# Altium schematic sheet Lora.SchDoc
size A; SheetNumber: 4; SheetTotal: 11
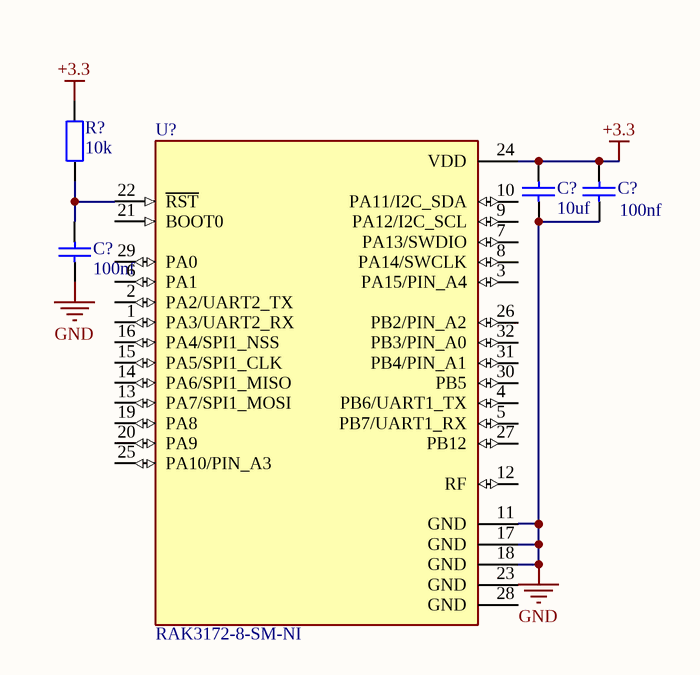
[diagram p0: Lora.SchDoc]

## Parts
(Parts that share a designator on the sheet are numbered #1, #2 ... from top to bottom, then left to right.)
C?#1  10uf  [tu 0805]
C?#2  100nf  [tu 0805]
C?#3  100nf  [tu 0805]
R?  10k  [tro smd 0805]
U?  RAK3172-8-SM-NI  [XCVR_RAK3172-8-SM-NI]

## Nets
+3.3: C?#1.1 C?#2.1 R?.2 U?.24(VDD)
GND: C?#1.2 C?#2.2 C?#3.2 U?.11(GND) U?.17(GND) U?.18(GND)
NetC?#3_1: C?#3.1 R?.1 U?.22(~{RST})

Not connected (* = marked no-connect by the designer): U? 1(PA3/UART2_RX) 2(PA2/UART2_TX) 3(PA15/PIN_A4) 4(PB6/UART1_TX) 5(PB7/UART1_RX) 6(PA1) 7(PA13/SWDIO) 8(PA14/SWCLK) 9(PA12/I2C_SCL) 10(PA11/I2C_SDA) 12(RF) 13(PA7/SPI1_MOSI) 14(PA6/SPI1_MISO) 15(PA5/SPI1_CLK) 16(PA4/SPI1_NSS) 19(PA8) 20(PA9) 21(BOOT0) 23(GND) 25(PA10/PIN_A3) 26(PB2/PIN_A2) 27(PB12) 28(GND) 29(PA0) 30(PB5) 31(PB4/PIN_A1) 32(PB3/PIN_A0)

## Library data of the parts
C?#1-C?#3 = Tu 0805 104 50V 10%: Dán; Don_Vi: Con; So_Chan: 2; Ten_Linh_Kien: Tụ 0805 104-100nF 10% 50V; Ma_Hang: MH004551; Chung_Loai: Dán; Kieu_Chan: *
R? = Tro 0805 1% 10R: Dán; Don_Vi: Con; So_Chan: 2; Ten_Linh_Kien: Trở 0805 1% 10R; Ma_Hang: MH005474; Chung_Loai: Dán; Kieu_Chan: *
U? = RAK3172-8-SM-NI: RF IC Transceiver LoRaWAN 864MHz, 865MHz, 868MHz 2V ~ 3.6V Supply, Without IPEX Connector; MF: RAKwireless Technology Limited; Package: None; Price: None; Check_prices: https://www.snapeda.com/parts/RAK3172-8-SM-NI/ESS+Technology/view-part/?ref=eda; Value: *; SnapEDA_Link: https://www.snapeda.com/parts/RAK3172-8-SM-NI/ESS+Technology/view-part/?ref=snap; MP: RAK3172-8-SM-NI; Availability: In Stock; Purchase-URL: https://pricing.snapeda.com/search?q=RAK3172-8-SM-NI&ref=eda